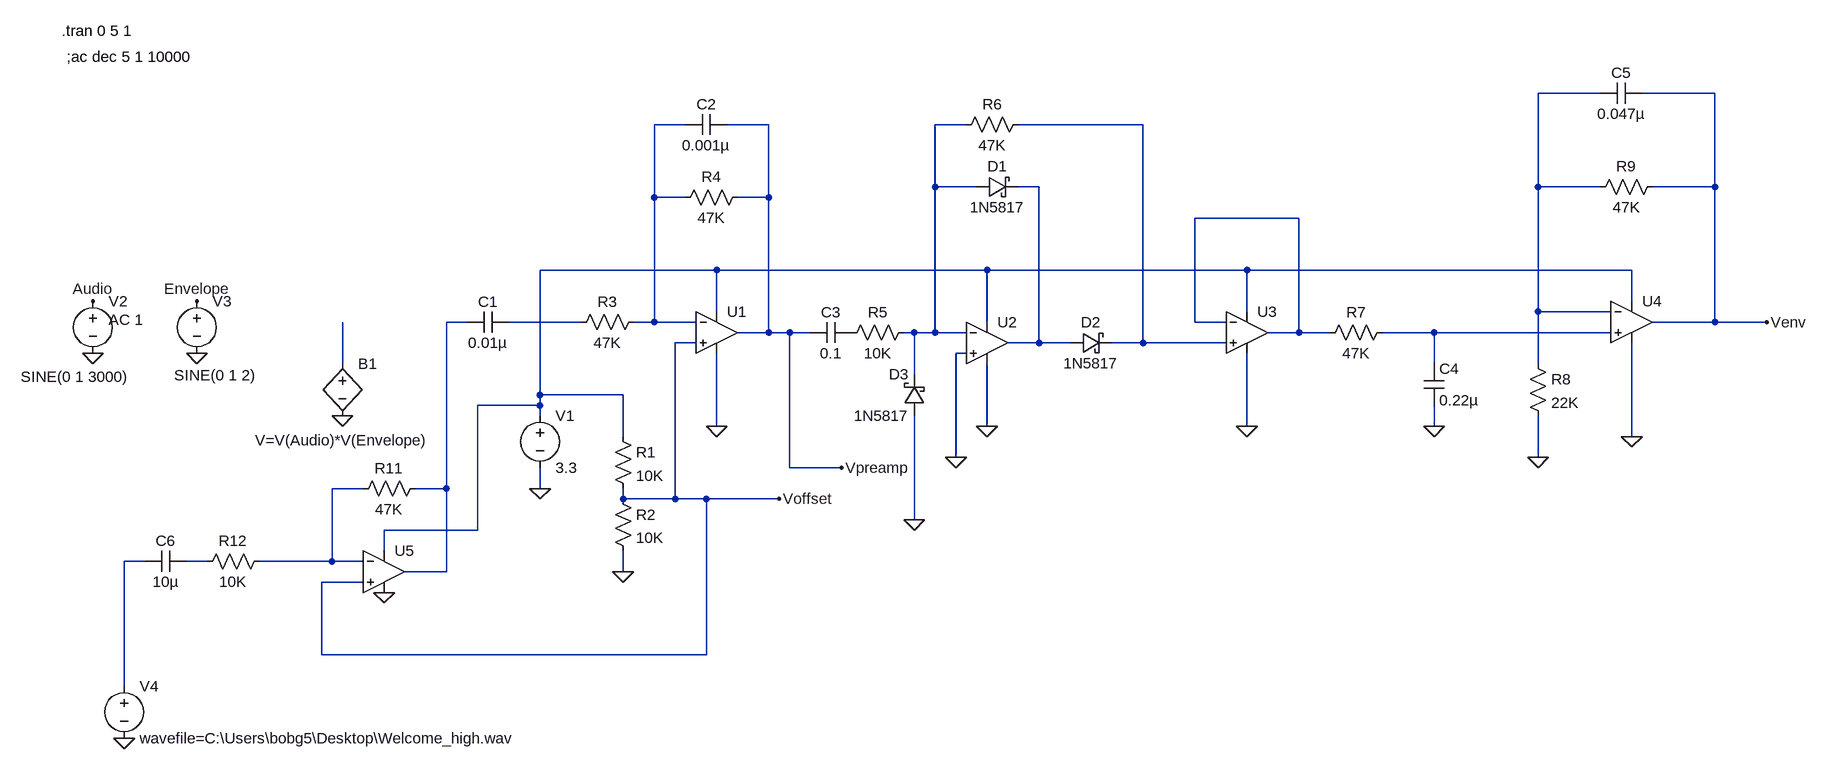
[diagram p0: schematic Analog_wavefile_input.asc]
Analog_wavefile_input.asc, the LTspice schematic file:
Version 4
SHEET 1 1884 820
WIRE 1552 -192 1456 -192
WIRE 1728 -192 1616 -192
WIRE 144 -144 96 -144
WIRE 272 -144 208 -144
WIRE 576 -144 528 -144
WIRE 848 -144 656 -144
WIRE 528 -48 528 -144
WIRE 592 -48 528 -48
WIRE 688 -48 656 -48
WIRE 1456 -48 1456 -192
WIRE 1552 -48 1456 -48
WIRE 1728 -48 1728 -192
WIRE 1728 -48 1632 -48
WIRE 96 -32 96 -144
WIRE 144 -32 96 -32
WIRE 272 -32 272 -144
WIRE 272 -32 224 -32
WIRE 1088 0 928 0
WIRE 192 80 -80 80
WIRE 608 80 192 80
WIRE 1008 80 608 80
WIRE 1600 80 1008 80
WIRE 1600 128 1600 80
WIRE 192 144 192 80
WIRE 1008 144 1008 80
WIRE 1456 144 1456 -48
WIRE 1568 144 1456 144
WIRE -192 160 -224 160
WIRE -16 160 -128 160
WIRE 96 160 96 -32
WIRE 96 160 64 160
WIRE 160 160 96 160
WIRE 608 160 608 80
WIRE 928 160 928 0
WIRE 976 160 928 160
WIRE 1728 160 1728 -48
WIRE 1728 160 1632 160
WIRE 1808 160 1728 160
WIRE 272 176 272 -32
WIRE 272 176 224 176
WIRE 304 176 272 176
WIRE 336 176 304 176
WIRE 496 176 480 176
WIRE 528 176 528 -48
WIRE 528 176 496 176
WIRE 576 176 528 176
WIRE 1088 176 1088 0
WIRE 1088 176 1040 176
WIRE 1136 176 1088 176
WIRE 1296 176 1216 176
WIRE 1568 176 1296 176
WIRE 160 192 128 192
WIRE 688 192 688 -48
WIRE 688 192 640 192
WIRE 736 192 688 192
WIRE 848 192 848 -144
WIRE 848 192 800 192
WIRE 976 192 848 192
WIRE 576 208 560 208
WIRE -384 224 -384 160
WIRE 1296 224 1296 176
WIRE 1456 224 1456 144
WIRE 496 240 496 176
WIRE -80 272 -80 80
WIRE 48 272 -80 272
WIRE -80 288 -80 272
WIRE -80 288 -176 288
WIRE -80 304 -80 288
WIRE 192 320 192 208
WIRE 608 320 608 224
WIRE 1008 320 1008 208
WIRE 1296 320 1296 288
WIRE 48 336 48 272
WIRE 1600 336 1600 192
WIRE 560 368 560 208
WIRE 1456 368 1456 304
WIRE 304 384 304 176
WIRE 384 384 304 384
WIRE -352 416 -400 416
WIRE -224 416 -224 160
WIRE -224 416 -272 416
WIRE -80 416 -80 384
WIRE 48 432 48 416
WIRE 128 432 128 192
WIRE 128 432 48 432
WIRE 176 432 128 432
WIRE 288 432 176 432
WIRE 496 464 496 304
WIRE -176 480 -176 288
WIRE -176 480 -320 480
WIRE -320 512 -320 480
WIRE -688 528 -720 528
WIRE -592 528 -624 528
WIRE -400 528 -400 416
WIRE -400 528 -512 528
WIRE -352 528 -400 528
WIRE -224 544 -224 416
WIRE -224 544 -288 544
WIRE 48 544 48 512
WIRE -352 560 -416 560
WIRE -416 672 -416 560
WIRE 176 672 176 432
WIRE 176 672 -416 672
WIRE -720 720 -720 528
FLAG -768 128 Audio
FLAG -608 128 Envelope
FLAG 288 432 Voffset
FLAG 384 384 Vpreamp
FLAG 1008 320 0
FLAG 608 320 0
FLAG 192 320 0
FLAG 48 544 0
FLAG -80 416 0
FLAG -384 304 0
FLAG -608 208 0
FLAG -768 208 0
FLAG 560 368 0
FLAG 1296 320 0
FLAG 1600 336 0
FLAG 1456 368 0
FLAG 1808 160 Venv
FLAG 496 464 0
FLAG -720 800 0
FLAG -320 576 0
SYMBOL OpAmps\\UniversalOpamp2 192 176 R0
SYMATTR InstName U1
SYMBOL res 32 320 R0
SYMATTR InstName R1
SYMATTR Value 10K
SYMBOL res 32 416 R0
SYMATTR InstName R2
SYMATTR Value 10K
SYMBOL voltage -80 288 R0
WINDOW 123 0 0 Left 0
WINDOW 39 0 0 Left 0
SYMATTR InstName V1
SYMATTR Value 3.3
SYMBOL res -32 176 R270
WINDOW 0 32 56 VTop 2
WINDOW 3 0 56 VBottom 2
SYMATTR InstName R3
SYMATTR Value 47K
SYMBOL res 128 -16 R270
WINDOW 0 32 56 VTop 2
WINDOW 3 0 56 VBottom 2
SYMATTR InstName R4
SYMATTR Value 47K
SYMBOL cap -192 176 R270
WINDOW 0 32 32 VTop 2
WINDOW 3 0 32 VBottom 2
SYMATTR InstName C1
SYMATTR Value 0.01µ
SYMBOL voltage -768 112 R0
WINDOW 123 24 44 Left 2
WINDOW 39 0 0 Left 0
WINDOW 3 -111 132 Left 2
SYMATTR Value2 AC 1
SYMATTR Value SINE(0 1 3000)
SYMATTR InstName V2
SYMBOL cap 144 -128 R270
WINDOW 0 32 32 VTop 2
WINDOW 3 0 32 VBottom 2
SYMATTR InstName C2
SYMATTR Value 0.001µ
SYMBOL voltage -608 112 R0
WINDOW 3 -35 130 Left 2
WINDOW 123 -72 210 Left 2
WINDOW 39 0 0 Left 0
SYMATTR Value SINE(0 1 2)
SYMATTR InstName V3
SYMBOL bv -384 208 R0
WINDOW 3 -134 134 Left 2
SYMATTR Value V=V(Audio)*V(Envelope)
SYMATTR InstName B1
SYMBOL OpAmps\\UniversalOpamp2 608 192 R0
SYMATTR InstName U2
SYMBOL cap 336 192 R270
WINDOW 0 32 32 VTop 2
WINDOW 3 0 32 VBottom 2
SYMATTR InstName C3
SYMATTR Value 0.1
SYMBOL res 384 192 R270
WINDOW 0 32 56 VTop 2
WINDOW 3 0 56 VBottom 2
SYMATTR InstName R5
SYMATTR Value 10K
SYMBOL res 560 -128 R270
WINDOW 0 32 56 VTop 2
WINDOW 3 0 56 VBottom 2
SYMATTR InstName R6
SYMATTR Value 47K
SYMBOL schottky 592 -32 R270
WINDOW 0 32 32 VTop 2
WINDOW 3 0 32 VBottom 2
SYMATTR InstName D1
SYMATTR Value 1N5817
SYMATTR Description Diode
SYMATTR Type diode
SYMBOL schottky 736 208 R270
WINDOW 0 32 32 VTop 2
WINDOW 3 0 32 VBottom 2
SYMATTR InstName D2
SYMATTR Value 1N5817
SYMATTR Description Diode
SYMATTR Type diode
SYMBOL OpAmps\\UniversalOpamp2 1008 176 R0
SYMATTR InstName U3
SYMBOL res 1120 192 R270
WINDOW 0 32 56 VTop 2
WINDOW 3 0 56 VBottom 2
SYMATTR InstName R7
SYMATTR Value 47K
SYMBOL cap 1280 224 R0
SYMATTR InstName C4
SYMATTR Value 0.22µ
SYMBOL OpAmps\\UniversalOpamp2 1600 160 R0
SYMATTR InstName U4
SYMBOL res 1440 208 R0
SYMATTR InstName R8
SYMATTR Value 22K
SYMBOL res 1536 -32 R270
WINDOW 0 32 56 VTop 2
WINDOW 3 0 56 VBottom 2
SYMATTR InstName R9
SYMATTR Value 47K
SYMBOL cap 1616 -208 R90
WINDOW 0 0 32 VBottom 2
WINDOW 3 32 32 VTop 2
SYMATTR InstName C5
SYMATTR Value 0.047µ
SYMBOL schottky 512 304 R180
WINDOW 0 24 64 Left 2
WINDOW 3 24 0 Left 2
SYMATTR InstName D3
SYMATTR Value 1N5817
SYMATTR Description Diode
SYMATTR Type diode
SYMBOL voltage -720 704 R0
SYMATTR InstName V4
SYMATTR Value wavefile=C:\Users\bobg5\Desktop\Welcome_high.wav
SYMBOL res -368 432 R270
WINDOW 0 32 56 VTop 2
WINDOW 3 0 56 VBottom 2
SYMATTR InstName R11
SYMATTR Value 47K
SYMBOL res -608 544 R270
WINDOW 0 32 56 VTop 2
WINDOW 3 0 56 VBottom 2
SYMATTR InstName R12
SYMATTR Value 10K
SYMBOL OpAmps\\UniversalOpamp2 -320 544 R0
SYMATTR InstName U5
SYMBOL cap -688 544 R270
WINDOW 0 32 32 VTop 2
WINDOW 3 0 32 VBottom 2
SYMATTR InstName C6
SYMATTR Value 10µ
TEXT -816 -288 Left 2 !.tran 0 5 1
TEXT -808 -248 Left 2 !;ac dec 5 1 10000

The netlist it stands for:
* Analog_wavefile_input.asc
XU1 Voffset N002 N007 0 Vpreamp level.2 Avol=1Meg GBW=10Meg Slew=10Meg ilimit=25m rail=0 Vos=0 phimargin=45 en=0 enk=0 in=0 ink=0 Rin=500Meg  ; pins IN+ IN- V+ V- OUT
R1 N007 Voffset 10K
R2 Voffset 0 10K
V1 N007 0 3.3
R3 N009 N002 47K
R4 N002 Vpreamp 47K
C1 N008 N009 0.01µ
V2 Audio 0 SINE(0 1 3000) AC 1
C2 N002 Vpreamp 0.001µ
V3 Envelope 0 SINE(0 1 2)
B1 N011 0 V=V(Audio)*V(Envelope)
XU2 0 N003 N007 0 N005 level.2 Avol=1Meg GBW=10Meg Slew=10Meg ilimit=25m rail=0 Vos=0 phimargin=45 en=0 enk=0 in=0 ink=0 Rin=500Meg  ; pins IN+ IN- V+ V- OUT
C3 Vpreamp P001 0.1
R5 P001 N003 10K
R6 N003 N004 47K
D1 N003 N005 1N5817
D2 N005 N004 1N5817
XU3 N004 N006 N007 0 N006 level.2 Avol=1Meg GBW=10Meg Slew=10Meg ilimit=25m rail=0 Vos=0 phimargin=45 en=0 enk=0 in=0 ink=0 Rin=500Meg  ; pins IN+ IN- V+ V- OUT
R7 N006 N010 47K
C4 N010 0 0.22µ
XU4 N010 N001 N007 0 Venv level.2 Avol=1Meg GBW=10Meg Slew=10Meg ilimit=25m rail=0 Vos=0 phimargin=45 en=0 enk=0 in=0 ink=0 Rin=500Meg  ; pins IN+ IN- V+ V- OUT
R8 N001 0 22K
R9 N001 Venv 47K
C5 Venv N001 0.047µ
D3 0 N003 1N5817
V4 N013 0 wavefile=C:\Users\bobg5\Desktop\Welcome_high.wav
R11 N012 N008 47K
R12 N014 N012 10K
XU5 Voffset N012 N007 0 N008 level.2 Avol=1Meg GBW=10Meg Slew=10Meg ilimit=25m rail=0 Vos=0 phimargin=45 en=0 enk=0 in=0 ink=0 Rin=500Meg  ; pins IN+ IN- V+ V- OUT
C6 N013 N014 10µ
.model D D
.lib standard.dio
.tran 0 5 1
;ac dec 5 1 10000
.lib UniversalOpamps2.sub
.backanno
.end